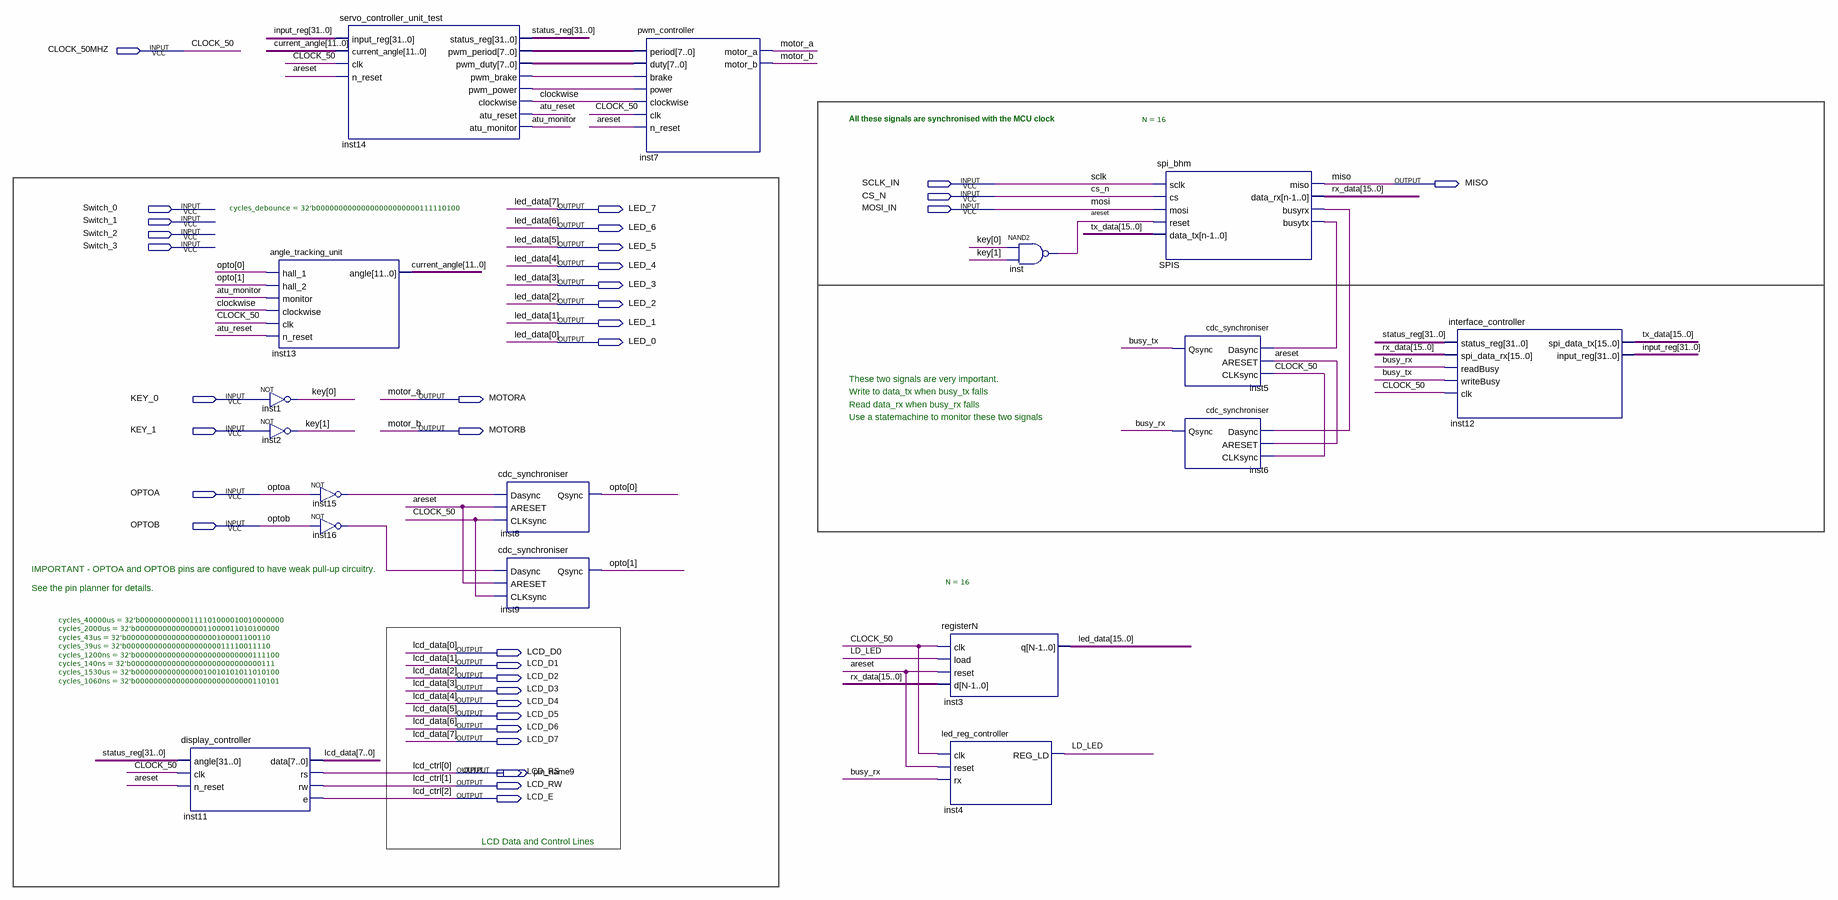
[diagram p0: schematic sheet]
// Quartus schematic spi_test.bdf as structural Verilog: 17 symbols, 35 pins
module spi_test (
  input  CLOCK_50MHZ,
  input  SCLK_IN,
  input  CS_N,
  input  Switch_0,
  input  MOSI_IN,
  input  Switch_1,
  input  Switch_2,
  input  Switch_3,
  input  KEY_0,
  input  KEY_1,
  input  OPTOA,
  input  OPTOB,
  output MISO,
  output LED_7,
  output LED_6,
  output LED_5,
  output LED_4,
  output LED_3,
  output LED_2,
  output LED_1,
  output LED_0,
  output MOTORA,
  output MOTORB,
  output LCD_D0,
  output LCD_D1,
  output LCD_D2,
  output LCD_D3,
  output LCD_D4,
  output LCD_D5,
  output LCD_D6,
  output LCD_D7,
  output LCD_RS,
  output pin_name9,
  output LCD_RW,
  output LCD_E
);

  wire areset, atu_monitor, atu_reset, busy_rx, busy_tx, clockwise, inst14_pwm_brake, inst14_pwm_power,
       inst15_out, inst16_out, LD_LED, SPIS_busyrx, SPIS_busytx;
  wire [1:0] key, opto;
  wire [7:0] inst14_pwm_duty, inst14_pwm_period;
  wire [11:0] current_angle;
  wire [15:0] rx_data, tx_data;
  wire [15:8] led_data;
  wire [31:0] input_reg, status_reg;

  display_controller #(.cycles_40000us(32'b00000000000111101000010010000000), .cycles_2000us(32'b00000000000000011000011010100000), .cycles_43us(32'b00000000000000000000100001100110), .cycles_39us(32'b00000000000000000000011110011110), .cycles_1200ns(32'b00000000000000000000000000111100), .cycles_140ns(32'b00000000000000000000000000000111), .cycles_1530us(32'b00000000000000010010101011010100), .cycles_1060ns(32'b00000000000000000000000000110101)) inst11 (
    .angle(status_reg), .clk(CLOCK_50MHZ), .n_reset(areset),
    .data({LCD_D7, LCD_D6, LCD_D5, LCD_D4, LCD_D3, LCD_D2, LCD_D1, LCD_D0}), .rs(LCD_RS), .rw(LCD_RW),
    .e(LCD_E));
  angle_tracking_unit #(.cycles_debounce(32'b00000000000000000000000111110100)) inst13 (
    .hall_1(opto[0]), .hall_2(opto[1]), .monitor(atu_monitor), .clockwise(clockwise), .clk(CLOCK_50MHZ),
    .n_reset(atu_reset), .angle(current_angle));
  not inst1 (key[0], KEY_0);
  not inst2 (key[1], KEY_1);
  not inst15 (inst15_out, OPTOA);
  not inst16 (inst16_out, OPTOB);
  servo_controller_unit_test inst14 (
    .input_reg(input_reg), .current_angle(current_angle), .clk(CLOCK_50MHZ), .n_reset(areset),
    .status_reg(status_reg), .pwm_period(inst14_pwm_period), .pwm_duty(inst14_pwm_duty),
    .pwm_brake(inst14_pwm_brake), .pwm_power(inst14_pwm_power), .clockwise(clockwise), .atu_reset(atu_reset),
    .atu_monitor(atu_monitor));
  cdc_synchroniser inst8 (.Dasync(inst15_out), .ARESET(areset), .CLKsync(CLOCK_50MHZ), .Qsync(opto[0]));
  cdc_synchroniser inst9 (.Dasync(inst16_out), .ARESET(areset), .CLKsync(CLOCK_50MHZ), .Qsync(opto[1]));
  pwm_controller inst7 (
    .period(inst14_pwm_period), .duty(inst14_pwm_duty), .brake(inst14_pwm_brake), .power(inst14_pwm_power),
    .clockwise(clockwise), .clk(CLOCK_50MHZ), .n_reset(areset), .motor_a(MOTORA), .motor_b(MOTORB));
  registerN #(.N(16)) inst3 (
    .clk(CLOCK_50MHZ), .load(LD_LED), .reset(areset), .d(rx_data),
    .q({led_data, LED_7, LED_6, LED_5, LED_4, LED_3, LED_2, LED_1, LED_0}));
  led_reg_controller inst4 (.clk(CLOCK_50MHZ), .reset(areset), .rx(busy_rx), .REG_LD(LD_LED));
  nand inst (areset, key[0], key[1]);
  spi_bhm #(.N(16)) SPIS (
    .sclk(SCLK_IN), .cs(CS_N), .mosi(MOSI_IN), .reset(areset), .data_tx(tx_data), .miso(MISO),
    .data_rx(rx_data), .busyrx(SPIS_busyrx), .busytx(SPIS_busytx));
  cdc_synchroniser inst5 (.Dasync(SPIS_busytx), .ARESET(areset), .CLKsync(CLOCK_50MHZ), .Qsync(busy_tx));
  cdc_synchroniser inst6 (.Dasync(SPIS_busyrx), .ARESET(areset), .CLKsync(CLOCK_50MHZ), .Qsync(busy_rx));
  interface_controller inst12 (
    .status_reg(status_reg), .spi_data_rx(rx_data), .readBusy(busy_rx), .writeBusy(busy_tx),
    .clk(CLOCK_50MHZ), .spi_data_tx(tx_data), .input_reg(input_reg));

  // Other names for the same wires on the sheet: CLOCK_50 = CLOCK_50MHZ; lcd_ctrl[2:0] = {LCD_E, LCD_RW, LCD_RS};
  //   lcd_data[7:0] = {LCD_D7, LCD_D6, LCD_D5, LCD_D4, LCD_D3, LCD_D2, LCD_D1, LCD_D0};
  //   led_data[7:0] = {LED_7, LED_6, LED_5, LED_4, LED_3, LED_2, LED_1, LED_0}; mosi = MOSI_IN; motor_a = MOTORA;
  //   motor_b = MOTORB; sclk = SCLK_IN

  // Notes on the sheet:
  //   All these signals are synchronised with the MCU clock
  //   These two signals are very important.
  //   Write to data_tx when busy_tx falls
  //   Read data_rx when busy_rx falls
  //   Use a statemachine to monitor these two signals
  //   IMPORTANT - OPTOA and OPTOB pins are configured to have weak pull-up circuitry. 
  //   See the pin planner for details.
  //   LCD Data and Control Lines
endmodule
